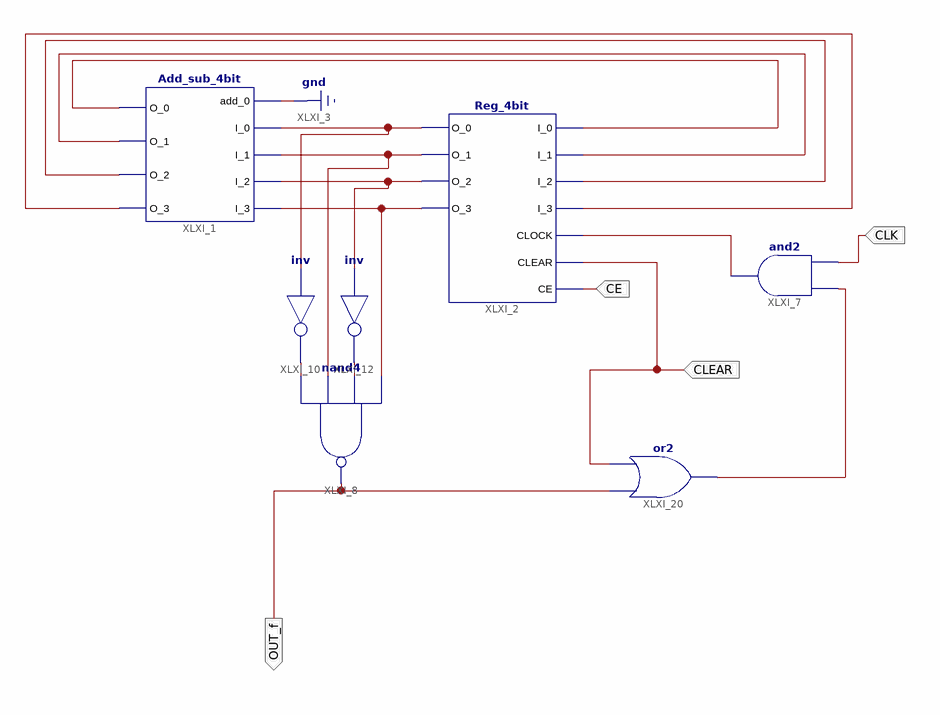
[diagram p0: schematic sheet 1]
// Xilinx ISE schematic decade_counter.sch (spartan3e) as structural Verilog: 7 symbols, 4 ports
module decade_counter (
  input  CLK,
  input  CLEAR,
  input  CE,
  output OUT_f
);

  wire OUT_1, XLXN_11, XLXN_17, XLXN_18, XLXN_43, XLXN_44, XLXN_45, XLXN_47, XLXN_48, XLXN_49, XLXN_66,
       XLXN_73;

  Add_sub_4bit XLXI_1 (
    .I_3(XLXN_11), .I_2(XLXN_49), .I_1(XLXN_48), .I_0(OUT_1), .add_0(1'b0), .O_3(XLXN_47), .O_2(XLXN_45),
    .O_1(XLXN_44), .O_0(XLXN_43));
  nand XLXI_8 (OUT_f, XLXN_18, XLXN_48, XLXN_17, XLXN_11);
  not XLXI_10 (XLXN_18, OUT_1);
  not XLXI_12 (XLXN_17, XLXN_49);
  and XLXI_7 (XLXN_66, CLK, XLXN_73);
  Reg_4bit XLXI_2 (
    .I_1(XLXN_44), .I_0(XLXN_43), .I_2(XLXN_45), .I_3(XLXN_47), .CLOCK(XLXN_66), .CLEAR(CLEAR),
    .O_3(XLXN_11), .O_2(XLXN_49), .O_1(XLXN_48), .O_0(OUT_1), .CE(CE));
  or XLXI_20 (XLXN_73, OUT_f, CLEAR);
endmodule
